# Altium schematic sheet APU_PCB.SchDoc
size A4
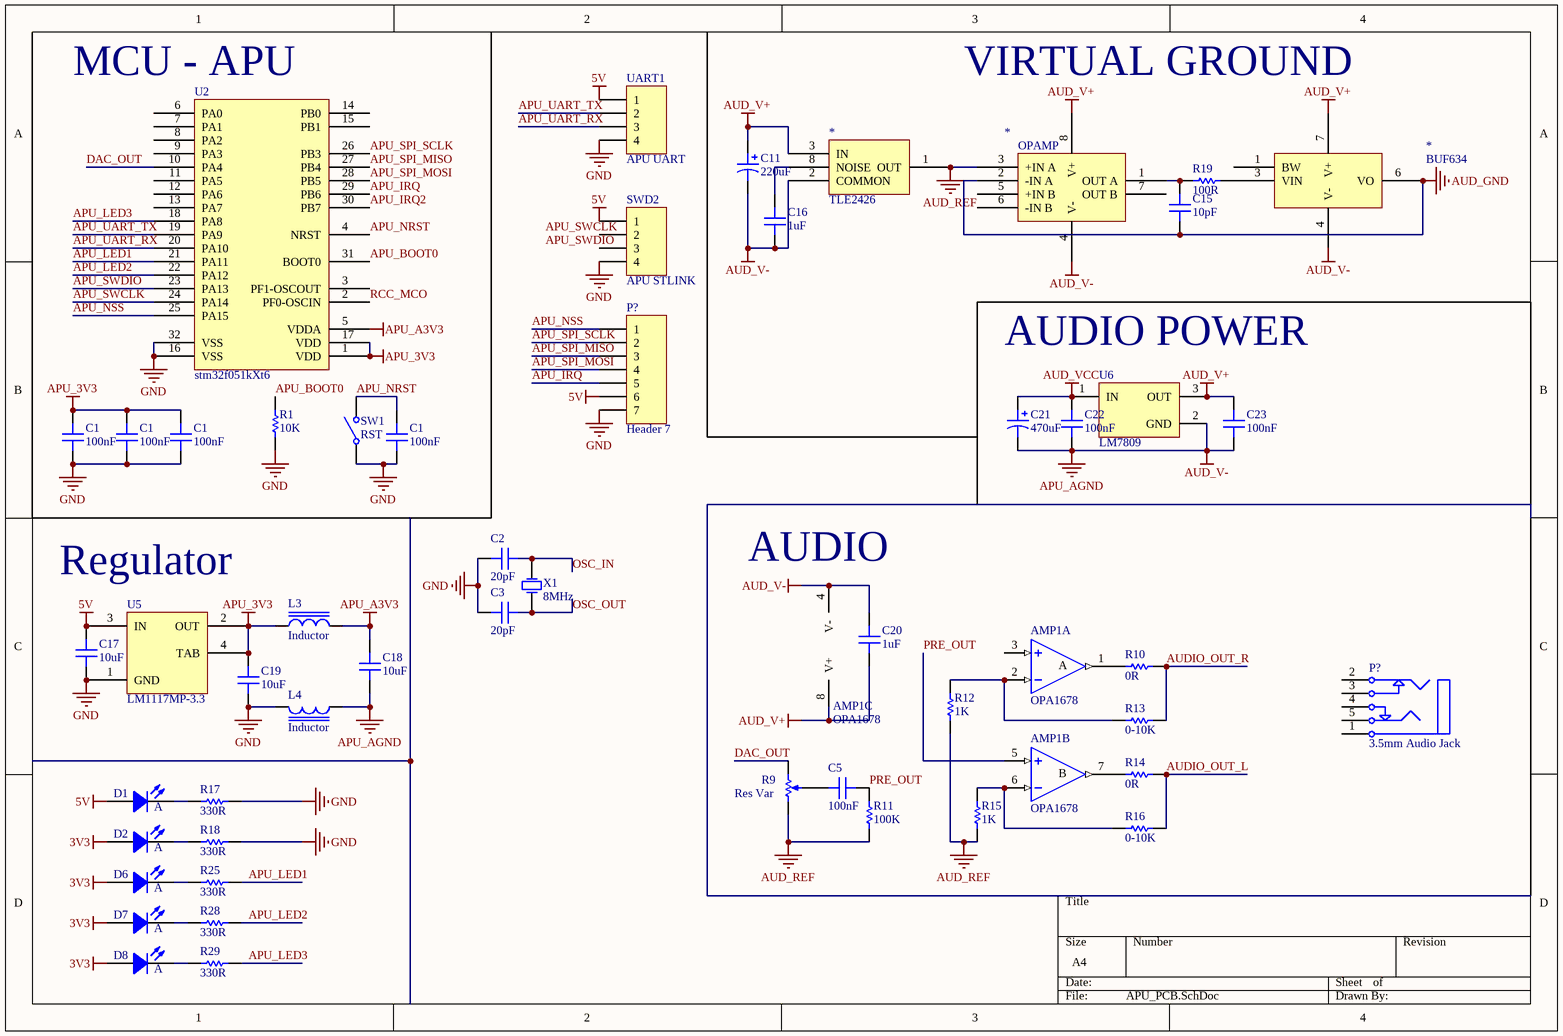
[diagram p0: APU_PCB.SchDoc]

## Parts
(Parts that share a designator on the sheet are numbered #1, #2 ... from top to bottom, then left to right.)
*#1  TLE2426  [SOIC127P600X175-8N]
*#2  BUF634  [SOIC127P600X175-8N]
*#3  OPAMP  [SOIC127P600X175-8N]
AMP1  OPA1678  [SOP-8]  (parts A,B,C of 3)
C1#1  100nF  [CC2012-0805]
C1#2  100nF  [CC2012-0805]
C1#3  100nF  [CC2012-0805]
C1#4  100nF  [CC2012-0805]
C2  20pF  [CC2012-0805]
C3  20pF  [CC2012-0805]
C5  100nF  [CC2012-0805]
C11  220uF  [CAP10x12]
C15  10pF  [CC2012-0805]
C16  1uF  [CC2012-0805]
C17  10uF  [CC2012-0805]
C18  10uF  [CC2012-0805]
C19  10uF  [CC2012-0805]
C20  1uF  [CC2012-0805]
C21  470uF  [CAP10x12]
C22  100nF  [CC2012-0805]
C23  100nF  [CC2012-0805]
D1  A  [D0805]
D2  A  [D0805]
D6  A  [D0805]
D7  A  [D0805]
D8  A  [D0805]
L3  Inductor  [CL3216-1206]
L4  Inductor  [CL3216-1206]
P?#1  Header 7  [HDR1X7]
P?#2  3.5mm Audio Jack  [STX-3120-5B]
R1  10K  [CR2012-0805]
R9  Res Var  [VR_PTV09A-4]
R10  0R  [CR2012-0805]
R11  100K  [CR2012-0805]
R12  1K  [CR2012-0805]
R13  0-10K  [CR2012-0805]
R14  0R  [CR2012-0805]
R15  1K  [CR2012-0805]
R16  0-10K  [CR2012-0805]
R17  330R  [CR2012-0805]
R18  330R  [CR2012-0805]
R19  100R  [CR2012-0805]
R25  330R  [CR2012-0805]
R28  330R  [CR2012-0805]
R29  330R  [CR2012-0805]
SW1  RST  [PUSH SWITCH 2-PIN]
SWD2  APU STLINK  [HDR1X4W]
U2  stm32f051kXt6  [QFP127P600-8N]
U5  LM1117MP-3.3  [MP04A_N]
U6  LM7809  [TO-220]
UART1  APU UART  [HDR1X4W]
X1  8MHz  [BCY-W2/E4.7]

## Nets
3V3: D2.1(A) D6.1(A) D7.1(A) D8.1(A)
5V: C17.2 D1.1(A) P?#1.6 SWD2.1 U5.3(IN) UART1.1
APU_3V3: C1#1.1 C1#2.1 C1#3.1 C19.2 L3.1 U2.1(VDD) U2.17(VDD) U5.2(OUT) U5.4(TAB)
APU_A3V3: C18.2 L3.2 U2.5(VDDA)
APU_AGND: *#1.2(COMMON) *#2.4(V-) *#3.4(V-) AMP1.4(V-) C11.2 C16.1 C18.1 C20.2 C21.2 C22.1 C23.1 L4.1 U6.2(GND)  [also labelled AUD_V-]
AUD_GND: *#2.6(VO) *#3.2(-IN_A) C15.1
AUD_REF: *#1.1(OUT) *#3.3(+IN_A) R9.3 R11.1 R12.2 R15.2
AUD_V+: *#1.3(IN) *#2.7(V+) *#3.8(V+) AMP1.8(V+) C11.1 C20.1 C23.2 U6.3(OUT)
AUD_VCC: C21.1 C22.2 U6.1(IN)
GND: C1#1.2 C1#2.2 C1#3.2 C1#4.2 C2.2 C3.2 C17.1 C19.1 L4.2 P?#1.7 R1.1 R17.2 R18.2 SW1.1(COMMON) SWD2.4 U2.16(VSS) U2.32(VSS) U5.1(GND) UART1.4
APU_BOOT0: R1.2 U2.31(BOOT0)
APU_IRQ: P?#1.5 U2.29(PB6)
APU_IRQ2: U2.30(PB7)
APU_LED1: R25.2 U2.21(PA11)
APU_LED2: R28.2 U2.22(PA12)
APU_LED3: R29.2 U2.18(PA8)
APU_NRST: C1#4.1 SW1.2(NO) U2.4(NRST)
APU_NSS: P?#1.1 U2.25(PA15)
APU_SPI_MISO: P?#1.3 U2.27(PB4)
APU_SPI_MOSI: P?#1.4 U2.28(PB5)
APU_SPI_SCLK: P?#1.2 U2.26(PB3)
APU_SWCLK: U2.24(PA14)
APU_SWDIO: U2.23(PA13)
APU_UART_RX: U2.20(PA10) UART1.3
APU_UART_TX: U2.19(PA9) UART1.2
AUDIO_OUT_L: R14.1 R16.1
AUDIO_OUT_R: R10.1 R13.1
DAC_OUT: R9.1 U2.10(PA4)
OSC_IN: C2.1 X1.2(OSC2)
OSC_OUT: C3.1 X1.1(OSC1)
PRE_OUT: AMP1.5(INB+) C5.2 R11.2
RCC_MCO: U2.2(PF0-OSCIN)
Net*#1_8: *#1.8(NOISE) C16.2
Net*#2_3: *#2.3(VIN) R19.2
Net*#3_1: *#3.1(OUT_A) C15.2 R19.1
NetAMP1_1: AMP1.1(OUTA) R10.2
NetAMP1_2: AMP1.2(INA-) R12.1 R13.2
NetAMP1_6: AMP1.6(INB-) R15.1 R16.2
NetAMP1_7: AMP1.7(OUTB) R14.2
NetC5_1: C5.1 R9.2
NetD1_2: D1.2(K) R17.1
NetD2_2: D2.2(K) R18.1
NetD6_2: D6.2(K) R25.1
NetD7_2: D7.2(K) R28.1
NetD8_2: D8.2(K) R29.1

Not connected (* = marked no-connect by the designer): *#2 1(BW); *#3 5(+IN_B) 6(-IN_B) 7(OUT_B); AMP1 3(INA+); P?#2 1 2 3 4 5; SWD2 2 3; U2 3(PF1-OSCOUT) 6(PA0) 7(PA1) 8(PA2) 9(PA3) 11(PA5) 12(PA6) 13(PA7) 14(PB0) 15(PB1)

## Notes on the sheet
- (near U2) MCU - APU
- VIRTUAL GROUND
- AUDIO POWER
- Regulator
- AUDIO
- Labels drawn without touching a wire or pin: APU_SWCLK, APU_SWDIO
- (in symbol OPA2340, part A) A
- (in symbol OPA2340, part B) B

## Library data of the parts
AMP1 = OPA2340: Single Supply Rail-to-Rail Operational Amplifier
C1#1-C1#4 C2 C3 C5 C15-C20 C22 C23 = Cap Semi: Capacitor (Semiconductor SIM Model); Published: 8-Jun-2000; LatestRevisionDate: 17-Jul-2002; LatestRevisionNote: Re-released for DXP Platform.; PackageReference: C1206; Publisher: Altium Limited
C11 C21 = Cap Pol DIP: Polarized Capacitor (Radial); Published: 8-Jun-2000; LatestRevisionDate: 17-Jul-2002; LatestRevisionNote: Re-released for DXP Platform.; Publisher: Altium Limited
D1 D2 D6-D8 = LED: Typical RED GaAs LED; Published: 8-Jun-2000; LatestRevisionDate: 08-Jul-2005; LatestRevisionNote: Mech Layer 1 removed.; PackageReference: LED-1; Publisher: Altium Limited
L3 L4 = Inductor: Value: 10uH; Published: 8-Jun-2000; Revision: July-2002: Re-released for DXP Platform.; Publisher: Altium Limited
P?#1 = Header 7: Header, 6-Pin; LatestRevisionDate: 17-Jul-2002; LatestRevisionNote: Re-released for DXP Platform.; Publisher: Altium Limited
P?#2 = Audio Jack 3P: Conductor Jack with 2 break contacts (normals) and 2 auxiliary make contacts
R1 R10-R19 R25 R28 R29 = Res Semi: Semiconductor Resistor; Published: 8-Jun-2000; LatestRevisionDate: 17-Jul-2002; LatestRevisionNote: Re-released for DXP Platform.; Publisher: Altium Limited
R9 = Res Var: Variable Resistor; Sim Note: Enter the Resistance value and the set point into parameter fields.; Published: 24-Mar-1999; LatestRevisionDate: 17-Jul-2002; LatestRevisionNote: Re-released for DXP Platform.; Publisher: Altium Limited
SW1 = SW-SPST: Single-Pole, Single-Throw Switch; Published: 24-Mar-1999; Revision: July-2002: Re-released for DXP Platform.; Publisher: Altium Limited
SWD2 UART1 = Header 4: Header, 4-Pin; Revision: 17-Jul-2002: Re-released for DXP Platform.; Publisher: Altium Limited
U5 = LM1117MP-3.3: 800mA Low-Dropout Linear Regulator; Manufacturer: National Semiconductor; CompType: LDO IC; PackageTopMarking: XYTT*N05A; Published: 27-Nov-2008; DatasheetVersion: Apr-2006; PackageVersion: revB, Apr-2003; PackageReference: MP04A; Publisher: Altium Limited; PackageDescription: Molded SOT-223, 6.50 x 3.56 x 1.6mm Body, 4 Lead, 2.3mm Pitch; PartNumber: LM1117MP-3.3; RoHS: O; PinCount: 4; DigiKeyPartNumber: LM1117MP-3.3CT-ND; Code_JEDEC: TO-261-AA; Code_IPC: SOT223-4; ComponentLink1Description: LM1117 Datasheet; ComponentLink1URL: http://www.national.com/ds/LM/LM1117.pdf; ComponentLink2Description: LM1117 Web Page; ComponentLink2URL: http://www.national.com/pf/LM/LM1117.html; ComponentLink3Description: MP04A Package Page; ComponentLink3URL: http://www.national.com/packaging/folders/mp04a.html
U6 = LM7805: 5V Regulator from National
X1 = XTAL: Crystal Oscillator; Published: 8-Jun-2000; Revision: July-2002: Re-released for DXP Platform.; Publisher: Altium Limited